# Altium schematic sheet gyorsulasmero.SchDoc: Gyorsulasmero
size A4; Author: Landi András; Organization: BME-AUT; DocumentNumber: 3; Revision: 21; SheetNumber: 3; SheetTotal: 3
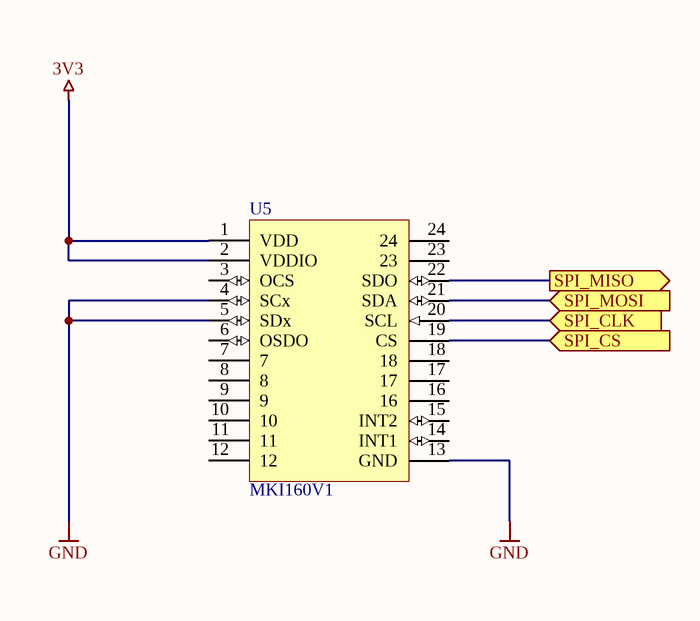
[diagram p0: gyorsulasmero.SchDoc]

## Parts
U5  MKI160V1  [FP_DIL24]

## Ports
SPI_CLK (in), SPI_CS (in), SPI_MISO (out), SPI_MOSI (in)

## Nets
3V3: U5.1(VDD) U5.2(VDDIO)
GND: U5.4(SCx) U5.5(SDx) U5.13(GND)
SPI_CLK: U5.20(SCL) ; port SPI_CLK
SPI_CS: U5.19(CS) ; port SPI_CS
SPI_MISO: U5.22(SDO) ; port SPI_MISO
SPI_MOSI: U5.21(SDA) ; port SPI_MOSI

Not connected (* = marked no-connect by the designer): U5 3(OCS) 6(OSDO) 7 8 9 10 11 12 14(INT1) 15(INT2) 16 17 18 23 24

## Notes on the sheet
- Title
- Size:
- Date:
- A4
- Number:
- Time:
- Revision:
- Sheet
- of
- File:

## Library data of the parts
U5 = MKI160V1: LSM6DS3 inertial module adapter; Name: MKI160V1 LSM6DS3 inertial module adapter; Reference: 511-STEVAL-MKI160V1; Supplier: Mouser